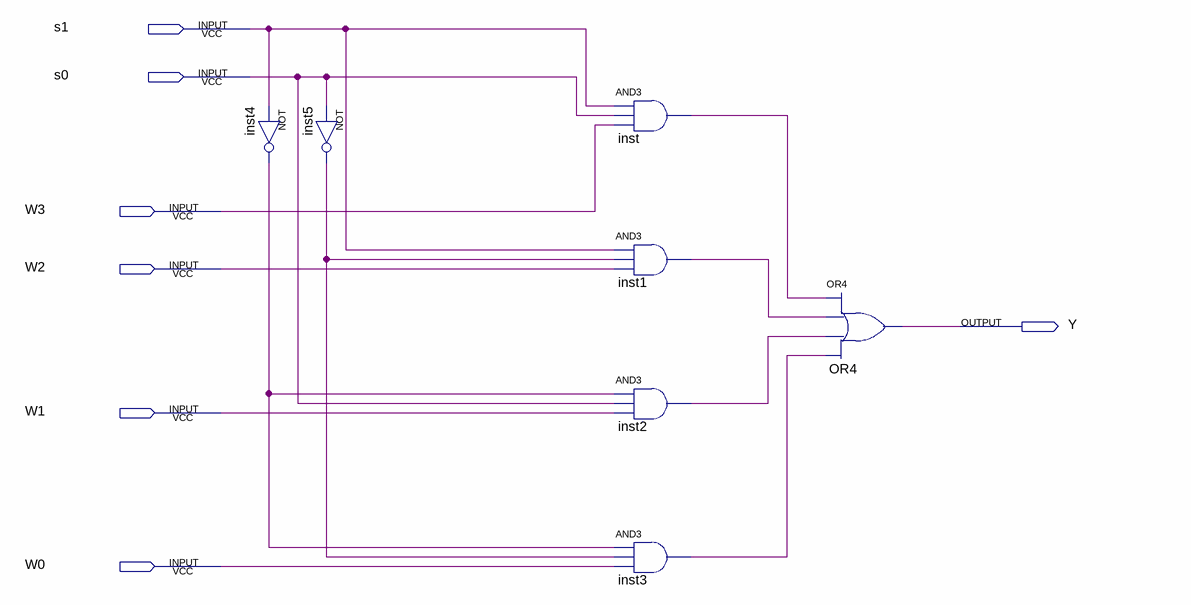
[diagram p0: schematic sheet]
// Quartus schematic 4to1mux.bdf as structural Verilog: 7 symbols, 7 pins
module \4to1mux  (
  input  s1,
  input  s0,
  input  W3,
  input  W2,
  input  W1,
  input  W0,
  output Y
);

  wire inst1_out, inst2_out, inst3_out, inst4_out, inst5_out, inst_out;

  not inst4 (inst4_out, s1);
  not inst5 (inst5_out, s0);
  and inst (inst_out, s1, s0, W3);
  and inst1 (inst1_out, s1, inst5_out, W2);
  and inst2 (inst2_out, inst4_out, s0, W1);
  and inst3 (inst3_out, inst4_out, inst5_out, W0);
  or OR4 (Y, inst_out, inst1_out, inst2_out, inst3_out);
endmodule
